# Altium project B106AA.PrjPcb (part 3 of 5)

## Sheet System Timer.SchDoc: System Timer Controller
size A4; ApprovedBy: Mehmet Günce Akkoyun; CheckedBy: Mehmet Günce Akkoyun; Author: Mehmet Günce Akkoyun; CompanyName: Ovoo Electronics; DrawnBy: Mehmet Günce Akkoyun; Engineer: Mehmet Günce Akkoyun; Organization: Ovoo Electronics; Address1: Küçük Ýhsaniye Mah.; Address2: Mýzraklý Sok. No:15; Address3: Meram / Konya; Address4: Turkiye; DocumentNumber: AA005; Revision: B106AA; SheetNumber: 7; SheetTotal: 37
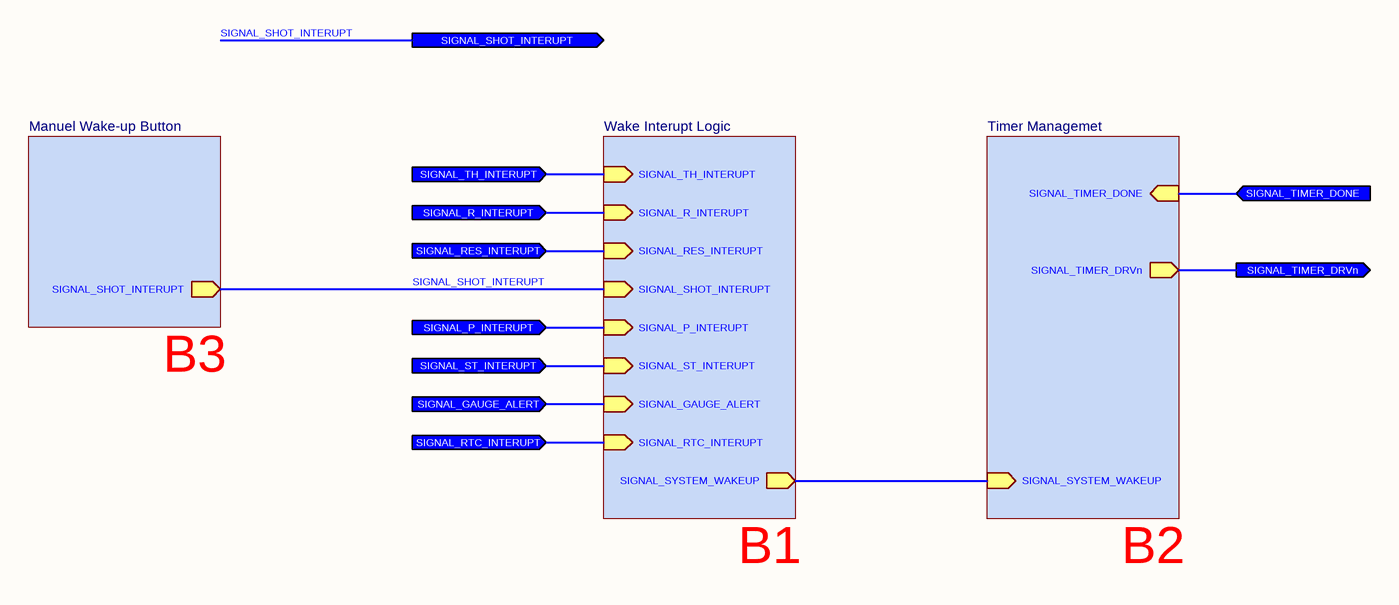
[diagram p20: System Timer.SchDoc]

### Sub-sheets
Manuel Wake-up Button = Manuel Wake-up and Latch.SchDoc: SIGNAL_SHOT_INTERUPT (out)
Timer Managemet = Time Management.SchDoc: SIGNAL_TIMER_DRVn (out), SIGNAL_TIMER_DONE (in), SIGNAL_SYSTEM_WAKEUP (in)
Wake Interupt Logic = System Wake Interupt Logic.SchDoc: SIGNAL_R_INTERUPT (in), SIGNAL_ST_INTERUPT (in), SIGNAL_SYSTEM_WAKEUP (out), SIGNAL_TH_INTERUPT (in), SIGNAL_RES_INTERUPT (in), SIGNAL_RTC_INTERUPT (in), SIGNAL_GAUGE_ALERT (in), SIGNAL_P_INTERUPT (in), SIGNAL_SHOT_INTERUPT (in)

### Ports
SIGNAL_GAUGE_ALERT (in), SIGNAL_P_INTERUPT (in), SIGNAL_R_INTERUPT (in), SIGNAL_RES_INTERUPT (in), SIGNAL_RTC_INTERUPT (in), SIGNAL_SHOT_INTERUPT (out), SIGNAL_ST_INTERUPT (in), SIGNAL_TH_INTERUPT (in), SIGNAL_TIMER_DONE (in), SIGNAL_TIMER_DRVn (out)

### Nets
SIGNAL_GAUGE_ALERT: port SIGNAL_GAUGE_ALERT, sheet Wake Interupt Logic/SIGNAL_GAUGE_ALERT
SIGNAL_P_INTERUPT: port SIGNAL_P_INTERUPT, sheet Wake Interupt Logic/SIGNAL_P_INTERUPT
SIGNAL_R_INTERUPT: port SIGNAL_R_INTERUPT, sheet Wake Interupt Logic/SIGNAL_R_INTERUPT
SIGNAL_RES_INTERUPT: port SIGNAL_RES_INTERUPT, sheet Wake Interupt Logic/SIGNAL_RES_INTERUPT
SIGNAL_RTC_INTERUPT: port SIGNAL_RTC_INTERUPT, sheet Wake Interupt Logic/SIGNAL_RTC_INTERUPT
SIGNAL_SHOT_INTERUPT: port SIGNAL_SHOT_INTERUPT, sheet Wake Interupt Logic/SIGNAL_SHOT_INTERUPT, sheet Manuel Wake-up Button/SIGNAL_SHOT_INTERUPT
SIGNAL_ST_INTERUPT: port SIGNAL_ST_INTERUPT, sheet Wake Interupt Logic/SIGNAL_ST_INTERUPT
SIGNAL_TH_INTERUPT: port SIGNAL_TH_INTERUPT, sheet Wake Interupt Logic/SIGNAL_TH_INTERUPT
SIGNAL_TIMER_DONE: port SIGNAL_TIMER_DONE, sheet Timer Managemet/SIGNAL_TIMER_DONE
SIGNAL_TIMER_DRVn: port SIGNAL_TIMER_DRVn, sheet Timer Managemet/SIGNAL_TIMER_DRVn
NetQ7_1: sheet Timer Managemet/SIGNAL_SYSTEM_WAKEUP, sheet Wake Interupt Logic/SIGNAL_SYSTEM_WAKEUP

### Notes on the sheet
- B3
- B1
- B2
- Title
- Size:
- Date:
- A4
- Number:
- Time:
- Revision:
- Sheet
- of
- File:

## Sheet Time Management.SchDoc: Sleep Management (Timer)
size A4; ApprovedBy: Mehmet Günce Akkoyun; CheckedBy: Mehmet Günce Akkoyun; Author: Mehmet Günce Akkoyun; CompanyName: Ovoo Electronics; DrawnBy: Mehmet Günce Akkoyun; Engineer: Mehmet Günce Akkoyun; Organization: Ovoo Electronics; Address1: Küçük Ýhsaniye Mah.; Address2: Mýzraklý Sok. No:15; Address3: Meram / Konya; Address4: Turkiye; DocumentNumber: AA005; Revision: B106AA; SheetNumber: 9; SheetTotal: 37
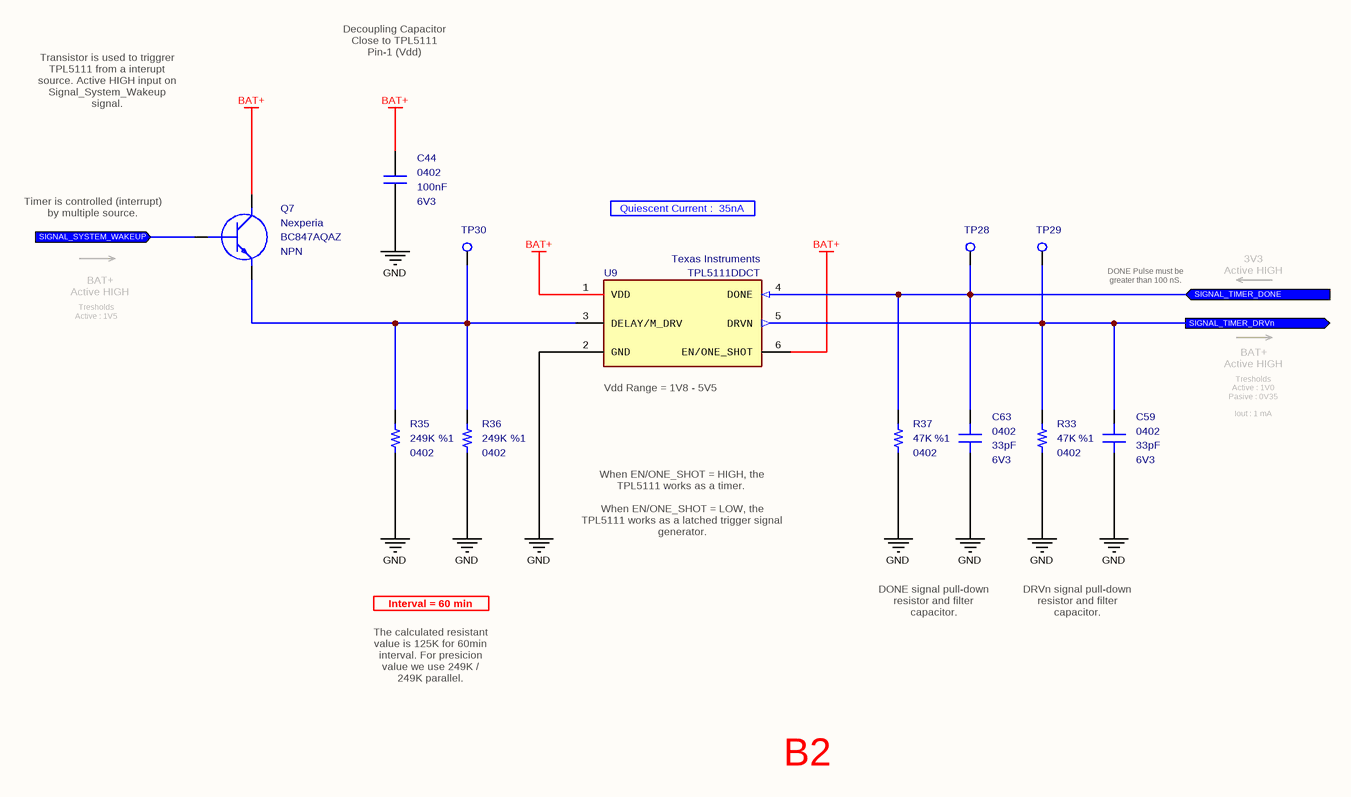
[diagram p21: Time Management.SchDoc]

### Parts
C44  value 100nF  Case: 0402  Voltage: 6V3  [CAPACITOR_0402]  (hidden comment: Multilayer Ceramic Capacitor)
C59  value 33pF  Case: 0402  Voltage: 6V3  [CAPACITOR_0402]  (hidden comment: Multilayer Ceramic Capacitor)
C63  value 33pF  Case: 0402  Voltage: 6V3  [CAPACITOR_0402]  (hidden comment: Multilayer Ceramic Capacitor)
Q7  Manufacturer_Name: Nexperia  Manufacturer_Part_Number: BC847AQAZ  Polarity: NPN  [SOT1215]  (hidden comment: Bipolar NPN Transistors)
R33  value 47K  Tolerance: %1  Case: 0402  [RESISTOR_0402]  (hidden comment: Thick Film Resistor)
R35  value 249K  Tolerance: %1  Case: 0402  [RESISTOR_0402]  (hidden comment: Thick Film Resistor)
R36  value 249K  Tolerance: %1  Case: 0402  [RESISTOR_0402]  (hidden comment: Thick Film Resistor)
R37  value 47K  Tolerance: %1  Case: 0402  [RESISTOR_0402]  (hidden comment: Thick Film Resistor)
TP28  PCB - Test Point  [Test_Pad - Hole]  (value not drawn)  (no BOM)
TP29  PCB - Test Point  [Test_Pad - Hole]  (value not drawn)  (no BOM)
TP30  PCB - Test Point  [Test_Pad - Hole]  (value not drawn)  (no BOM)
U9  Manufacturer _Part_Number: TPL5111DDCT  Manufacturer_Name: Texas Instruments  [SOT-23-6]  (hidden comment: Nanopower Timer IC)

### Ports
SIGNAL_SYSTEM_WAKEUP (in), SIGNAL_TIMER_DONE (in), SIGNAL_TIMER_DRVn (out)

### Nets
BAT+: C44.2 Q7.3(C) U9.1(VDD) U9.6(EN/ONE_SHOT)
GND: C44.1 C59.1 C63.1 R33.1 R35.1 R36.1 R37.1 U9.2(GND)
SIGNAL_TIMER_DONE: C63.2 R37.2 TP28.1 U9.4(DONE) ; port SIGNAL_TIMER_DONE
SIGNAL_TIMER_DRVn: C59.2 R33.2 TP29.1 U9.5(DRVN) ; port SIGNAL_TIMER_DRVn
NetQ7_1: Q7.1(B) ; port SIGNAL_SYSTEM_WAKEUP
NetQ7_2: Q7.2(E) R35.2 R36.2 TP30.1 U9.3(DELAY/M_DRV)

### Notes on the sheet
- Decoupling Capacitor
  Close to TPL5111
  Pin-1 (Vdd)
- Transistor is used to triggrer TPL5111 from a interupt source. Active HIGH input on Signal_System_Wakeup signal.
- (near Q7) Timer is controlled (interrupt) by multiple source.
- Quiescent Current :  35nA
- 3V3
  Active HIGH
- BAT+
  Active HIGH
- Tresholds
  Active : 1V5
- DONE Pulse must be greater than 100 nS.
- (near U9) Vdd Range = 1V8 - 5V5
- Tresholds
  Active : 1V0
  Pasive : 0V35
  Iout : 1 mA
- When EN/ONE_SHOT = HIGH, the TPL5111 works as a timer.
  When EN/ONE_SHOT = LOW, the TPL5111 works as a latched trigger signal generator.
- Interval = 60 min
- DONE signal pull-down resistor and filter capacitor.
- DRVn signal pull-down resistor and filter capacitor.
- The calculated resistant value is 125K for 60min interval. For presicion value we use 249K / 249K parallel.
- B2
- Title
- Size:
- Date:
- A4
- Number:
- Time:
- Revision:
- Sheet
- of
- File:

### Library data of the parts
C44 = Capacitor - 100nF [0402-6V3]: Capacitor - 100nF [0402-6V3] (Ceramic); Manufacturer_Name: AVX; Manufacturer_Part_Number: 04026D104KAT4A; Dielectric: X5R; Tolerance: %10; Height: 0.25mm; Mouser_Part_Number: 581-04026D104KAT4A; ComponentLink1Description: Mouser; ComponentLink1URL: https://www.mouser.com.tr/ProductDetail/AVX/04026D104KAT4A?qs=sGAEpiMZZMs0AnBnWHyRQPg4iYkCw7IMED%2F4kpqgf7w%3D; ComponentLink2Description: DataSheet; ComponentLink2URL: https://www.mouser.com.tr/datasheet/2/40/cx5r-776519.pdf; ROHS: Yes; Maximum Operating Temperature: +85; Minimum Operating Temperature: -55; Supplier 1: Avnet; Supplier Part Number 1: 04026D104KAT4A
C59 C63 = Capacitor - 33pF [0402-6V3]: Capacitor - 33pF [0402] (Ceramic); Manufacturer_Name: Kemet; Manufacturer_Part_Number: C0402C330J9RACAUTO; Dielectric: X7R; Tolerance: 10%; Height: 0.5mm; Mouser_Part_Number: 80-C0402C330J9RAUTO; Maximum Operating Temperature: +125; Minimum Operating Temperature: -55; ROHS: Yes; ComponentLink1Description: DataSheet; ComponentLink1URL: https://api.kemet.com/component-edge/download/datasheet/C0402C330J9RACAUTO.pdf; ComponentLink2Description: Mouser; ComponentLink2URL: https://www.mouser.com/Search/Refine.aspx?Keyword=80-C0402C330J9RAUTO; Supplier 1: Mouser; Supplier Part Number 1: 80-C0402C330J9RAUTO
Q7 = Transistor - BC847: as Q2-Q4 on sheet GSM LED Indicators; Mouser_Part_Number: 771-BC847AQAZ; ComponentLink1Description: DataSheet; ComponentLink1URL: https://www.mouser.com.tr/datasheet/2/916/BC847XQA_SER-1598405.pdf; ComponentLink2Description: Mouser; ComponentLink2URL: https://www.mouser.com.tr/ProductDetail/Nexperia/BC847AQAZ?qs=%2Fha2pyFaduhKMCPKNtQimeJpXTw9z4AqURd2YARs8DVICZNv3AT9Dw%3D%3D; Case: DFN-1010D-3; Supplier 1: Mouser; Supplier 2: Digi-Key; Supplier Part Number 1: 771-BC847AQAZ; Supplier Part Number 2: 1727-2545-1-ND
R33 R37 = Resistor - 47K: Thick Film Resistors - SMD 1/16 W 47 Kohms 1%; Manufacturer_Name: Vishay; Manufacturer_Part_Number: CRCW040247K0FKED; Height: 0.4mm; Mouser_Part_Number: 71-CRCW0402-47K-E3; ComponentLink1Description: DataSheet; ComponentLink1URL: https://www.mouser.com.tr/datasheet/2/427/dcrcwe3-1762152.pdf; ComponentLink2Description: Mouser; ComponentLink2URL: https://www.mouser.com.tr/ProductDetail/Vishay-Dale/CRCW040247K0FKED?qs=sGAEpiMZZMu61qfTUdNhG2DpbjADlD3GL%252B3h1elTxqU%3D; Supplier 1: Mouser; Supplier 2: Digi-Key; Supplier Part Number 1: 71-CRCW040247K0FKEDH; Supplier Part Number 2: 541-47.0KYCT-ND
R35 R36 = Resistor - 249K: Thick Film Resistors - SMD 1/16 W 249 Kohms 1%; Manufacturer_Name: Vishay; Manufacturer_Part_Number: CRCW0402249KFKED; Height: 0.35mm; Mouser_Part_Number: 71-CRCW0402-249K-E3; ComponentLink1Description: DataSheet; ComponentLink1URL: https://www.mouser.com.tr/datasheet/2/427/dcrcwe3-1762152.pdf; ComponentLink2Description: Mouser; ComponentLink2URL: https://www.mouser.com.tr/ProductDetail/Vishay-Dale/CRCW0402249KFKED?qs=sGAEpiMZZMu61qfTUdNhG2DpbjADlD3GEiYBObatoAI%3D; Supplier 1: Mouser; Supplier 2: Digi-Key; Supplier Part Number 1: 71-CRCW0402-249K-E3; Supplier Part Number 2: 541-249KLCT-ND
TP28-TP30 = PCB - Test Point: Test Point
U9 = IC - TPL5111: Timers & Support Products Ultra Low Power System Timer (35 nA) for Power Gating in duty cycled applications.; Supply Voltage - Min: 1.8V; Supply Voltage - Max: 5.5V; Height: 1.1mm; ROHS: Yes; Minimum Operating Temperature: -40; Maximum Operating Temperature: +105; ComponentLink1Description: DataSheet; ComponentLink1URL: http://www.ti.com/general/docs/suppproductinfo.tsp?distId=26&gotoUrl=http%3A%2F%2Fwww.ti.com%2Flit%2Fgpn%2Ftpl5111; Mouser_Part_Number: 595-TPL5111DDCT; ComponentLink2Description: Mouser; ComponentLink2URL: https://www.mouser.com/Search/Refine.aspx?Keyword=595-TPL5111DDCT; Supplier 1: Mouser; Supplier 2: Arrow; Supplier 3: Farnell; Supplier 4: Digi-Key; Supplier 5: Newark; Supplier Part Number 1: 595-TPL5111DDCT; Supplier Part Number 2: TPL5111DDCT; Supplier Part Number 3: 3006922; Supplier Part Number 4: 296-42621-1-ND; Supplier Part Number 5: 28AH5709

## Sheet System Wake Interupt Logic.SchDoc: System Wake up Resources Logic Gates
size A3; ApprovedBy: Mehmet Günce Akkoyun; CheckedBy: Mehmet Günce Akkoyun; Author: Mehmet Günce Akkoyun; CompanyName: Ovoo Electronics; DrawnBy: Mehmet Günce Akkoyun; Engineer: Mehmet Günce Akkoyun; Organization: Ovoo Electronics; Address1: Küçük Ýhsaniye Mah.; Address2: Mýzraklý Sok. No:15; Address3: Meram / Konya; Address4: Turkiye; DocumentNumber: AA005; Revision: B106AA; SheetNumber: 8; SheetTotal: 37
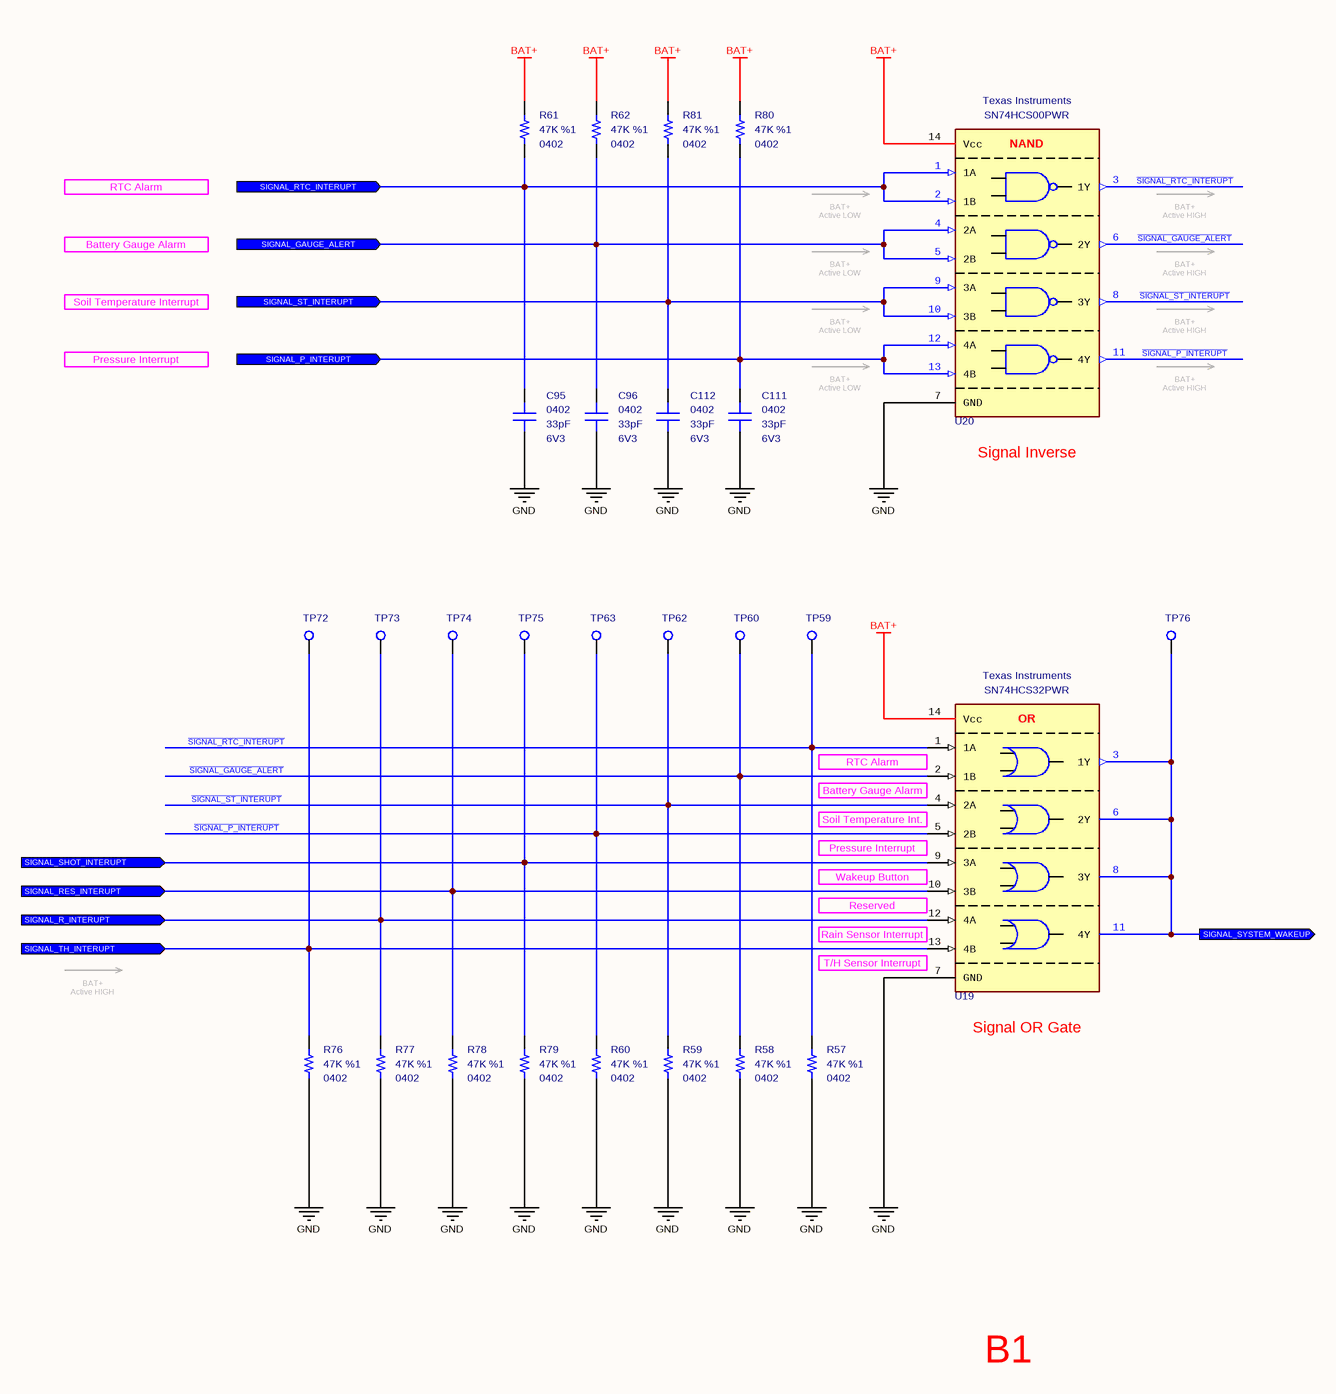
[diagram p22: System Wake Interupt Logic.SchDoc]

### Parts
C95  value 33pF  Case: 0402  Voltage: 6V3  [CAPACITOR_0402]  (hidden comment: Multilayer Ceramic Capacitor)
C96  value 33pF  Case: 0402  Voltage: 6V3  [CAPACITOR_0402]  (hidden comment: Multilayer Ceramic Capacitor)
C111  value 33pF  Case: 0402  Voltage: 6V3  [CAPACITOR_0402]  (hidden comment: Multilayer Ceramic Capacitor)
C112  value 33pF  Case: 0402  Voltage: 6V3  [CAPACITOR_0402]  (hidden comment: Multilayer Ceramic Capacitor)
R57  value 47K  Tolerance: %1  Case: 0402  [RESISTOR_0402]  (hidden comment: Thick Film Resistor)
R58  value 47K  Tolerance: %1  Case: 0402  [RESISTOR_0402]  (hidden comment: Thick Film Resistor)
R59  value 47K  Tolerance: %1  Case: 0402  [RESISTOR_0402]  (hidden comment: Thick Film Resistor)
R60  value 47K  Tolerance: %1  Case: 0402  [RESISTOR_0402]  (hidden comment: Thick Film Resistor)
R61  value 47K  Tolerance: %1  Case: 0402  [RESISTOR_0402]  (hidden comment: Thick Film Resistor)
R62  value 47K  Tolerance: %1  Case: 0402  [RESISTOR_0402]  (hidden comment: Thick Film Resistor)
R76  value 47K  Tolerance: %1  Case: 0402  [RESISTOR_0402]  (hidden comment: Thick Film Resistor)
R77  value 47K  Tolerance: %1  Case: 0402  [RESISTOR_0402]  (hidden comment: Thick Film Resistor)
R78  value 47K  Tolerance: %1  Case: 0402  [RESISTOR_0402]  (hidden comment: Thick Film Resistor)
R79  value 47K  Tolerance: %1  Case: 0402  [RESISTOR_0402]  (hidden comment: Thick Film Resistor)
R80  value 47K  Tolerance: %1  Case: 0402  [RESISTOR_0402]  (hidden comment: Thick Film Resistor)
R81  value 47K  Tolerance: %1  Case: 0402  [RESISTOR_0402]  (hidden comment: Thick Film Resistor)
TP59  PCB - Test Point  [Test_Pad - Hole]  (value not drawn)  (no BOM)
TP60  PCB - Test Point  [Test_Pad - Hole]  (value not drawn)  (no BOM)
TP62  PCB - Test Point  [Test_Pad - Hole]  (value not drawn)  (no BOM)
TP63  PCB - Test Point  [Test_Pad - Hole]  (value not drawn)  (no BOM)
TP72  PCB - Test Point  [Test_Pad - Hole]  (value not drawn)  (no BOM)
TP73  PCB - Test Point  [Test_Pad - Hole]  (value not drawn)  (no BOM)
TP74  PCB - Test Point  [Test_Pad - Hole]  (value not drawn)  (no BOM)
TP75  PCB - Test Point  [Test_Pad - Hole]  (value not drawn)  (no BOM)
TP76  PCB - Test Point  [Test_Pad - Hole]  (value not drawn)  (no BOM)
U19  Manufacturer_Part_Number: SN74HCS32PWR  Manufacturer_Name: Texas Instruments  [TSSOP-14]  (hidden comment: Logic Gate (OR))
U20  Manufacturer_Part_Number: SN74HCS00PWR  Manufacturer_Name: Texas Instruments  [TSSOP-14]  (hidden comment: Logic Gate (NAND))

### Ports
SIGNAL_GAUGE_ALERT (in), SIGNAL_P_INTERUPT (in), SIGNAL_R_INTERUPT (in), SIGNAL_RES_INTERUPT (in), SIGNAL_RTC_INTERUPT (in), SIGNAL_SHOT_INTERUPT (in), SIGNAL_ST_INTERUPT (in), SIGNAL_SYSTEM_WAKEUP (out), SIGNAL_TH_INTERUPT (in)

### Nets
BAT+: R61.2 R62.2 R80.2 R81.2 U19.14(Vcc) U20.14(Vcc)
GND: C95.1 C96.1 C111.1 C112.1 R57.1 R58.1 R59.1 R60.1 R76.1 R77.1 R78.1 R79.1 U19.7(GND) U20.7(GND)
~{SIGNAL_GAUGE_ALERT}: R58.2 TP60.1 U19.2(1B) U20.6(2Y)
~{SIGNAL_P_INTERUPT}: R60.2 TP63.1 U19.5(2B) U20.11(4Y)
~{SIGNAL_RTC_INTERUPT}: R57.2 TP59.1 U19.1(1A) U20.3(1Y)
~{SIGNAL_ST_INTERUPT}: R59.2 TP62.1 U19.4(2A) U20.8(3Y)
SIGNAL_GAUGE_ALERT: C96.2 R62.1 U20.4(2A) U20.5(2B) ; port SIGNAL_GAUGE_ALERT
SIGNAL_P_INTERUPT: C111.2 R80.1 U20.12(4A) U20.13(4B) ; port SIGNAL_P_INTERUPT
SIGNAL_R_INTERUPT: R77.2 TP73.1 U19.12(4A) ; port SIGNAL_R_INTERUPT
SIGNAL_RES_INTERUPT: R78.2 TP74.1 U19.10(3B) ; port SIGNAL_RES_INTERUPT
SIGNAL_RTC_INTERUPT: C95.2 R61.1 U20.1(1A) U20.2(1B) ; port SIGNAL_RTC_INTERUPT
SIGNAL_SHOT_INTERUPT: R79.2 TP75.1 U19.9(3A) ; port SIGNAL_SHOT_INTERUPT
SIGNAL_ST_INTERUPT: C112.2 R81.1 U20.9(3A) U20.10(3B) ; port SIGNAL_ST_INTERUPT
SIGNAL_TH_INTERUPT: R76.2 TP72.1 U19.13(4B) ; port SIGNAL_TH_INTERUPT
NetQ7_1: TP76.1 U19.3(1Y) U19.6(2Y) U19.8(3Y) U19.11(4Y) ; port SIGNAL_SYSTEM_WAKEUP

### Notes on the sheet
- RTC Alarm
- BAT+
  Active LOW
- BAT+
  Active HIGH
- Battery Gauge Alarm
- Soil Temperature Interrupt
- Pressure Interrupt
- (near U20) Signal Inverse
- (near U19) RTC Alarm
- (near U19) Battery Gauge Alarm
- (near U19) Wakeup Button
- (near U19) Pressure Interrupt
- (near U19) Soil Temperature Int.
- (near U19) Rain Sensor Interrupt
- (near U19) Reserved
- (near U19) T/H Sensor Interrupt
- (near U19) Signal OR Gate
- B1
- Title
- Size:
- Date:
- A3
- Number:
- Time:
- Revision:
- Sheet
- of
- File:
- (in symbol IC - SN74HCS00) NAND
- (in symbol IC - SN74HCS32) OR

### Library data of the parts
C95 C96 C111 C112 = Capacitor - 33pF [0402-6V3]: as C59 on sheet Time Management; Height: 0.5mm; Mouser_Part_Number: 80-C0402C330J9RAUTO; Maximum Operating Temperature: +125; Minimum Operating Temperature: -55; ROHS: Yes; ComponentLink1Description: DataSheet; ComponentLink1URL: https://api.kemet.com/component-edge/download/datasheet/C0402C330J9RACAUTO.pdf; ComponentLink2Description: Mouser; ComponentLink2URL: https://www.mouser.com/Search/Refine.aspx?Keyword=80-C0402C330J9RAUTO; Supplier 1: Mouser; Supplier Part Number 1: 80-C0402C330J9RAUTO
R57-R62 R76-R81 = Resistor - 47K: as R33 on sheet Time Management; Height: 0.4mm; Mouser_Part_Number: 71-CRCW0402-47K-E3; ComponentLink1Description: DataSheet; ComponentLink1URL: https://www.mouser.com.tr/datasheet/2/427/dcrcwe3-1762152.pdf; ComponentLink2Description: Mouser; ComponentLink2URL: https://www.mouser.com.tr/ProductDetail/Vishay-Dale/CRCW040247K0FKED?qs=sGAEpiMZZMu61qfTUdNhG2DpbjADlD3GL%252B3h1elTxqU%3D; Supplier 1: Mouser; Supplier 2: Digi-Key; Supplier Part Number 1: 71-CRCW040247K0FKEDH; Supplier Part Number 2: 541-47.0KYCT-ND
TP59 TP60 TP62 TP63 TP72-TP76 = PCB - Test Point: Test Point
U19 = IC - SN74HCS32: Logic Gates Quadruple 2-input OR gates with Schmitt-trigger inputs 14-TSSOP -40 to 125; Mouser_Part_Number: 595-SN74HCS32PWR; ComponentLink1Description: DataSheet; ComponentLink1URL: http://www.ti.com/lit/ds/symlink/sn74hcs32-q1.pdf; ComponentLink2Description: Mouser; ComponentLink2URL: https://eu.mouser.com/ProductDetail/Texas-Instruments/SN74HCS32PWR?qs=vHuUswq2%252BswZ59iFDX%252BOFA%3D%3D; Minimum Operating Temperature: -40; Maximum Operating Temperature: +125; Case: TSSOP-14; Supplier 1: Mouser; Supplier 2: Digi-Key; Supplier Part Number 1: 595-SN74HCS32PWR; Supplier Part Number 2: 296-SN74HCS32PWRCT-ND
U20 = IC - SN74HCS00: Logic Gates Quadruple 2-input NAND gates with Schmitt-trigger inputs 14-TSSOP -40 to 125; Mouser_Part_Number: 595-SN74HCS00PWR; ComponentLink1Description: DataSheet; ComponentLink1URL: http://www.ti.com/lit/ds/symlink/sn74hcs00.pdf; ComponentLink2Description: Mouser; ComponentLink2URL: https://eu.mouser.com/ProductDetail/Texas-Instruments/SN74HCS00PWR?qs=xZ%2FP%252Ba9zWqbLfT34gQ2%2FMQ%3D%3D; Minimum Operating Temperature: -40; Maximum Operating Temperature: +125; Case: TSSOP-14; Supplier 1: Mouser; Supplier 2: Digi-Key; Supplier Part Number 1: 595-SN74HCS00PWR; Supplier Part Number 2: 296-SN74HCS00PWRCT-ND

## Sheet Manuel Wake-up and Latch.SchDoc: Manuel Wake-up Button
size A4; ApprovedBy: Mehmet Günce Akkoyun; CheckedBy: Mehmet Günce Akkoyun; Author: Mehmet Günce Akkoyun; CompanyName: Ovoo Electronics; DrawnBy: Mehmet Günce Akkoyun; Engineer: Mehmet Günce Akkoyun; Organization: Ovoo Electronics; Address1: Küçük Ýhsaniye Mah.; Address2: Mýzraklý Sok. No:15; Address3: Meram / Konya; Address4: Turkiye; DocumentNumber: AA005; Revision: B106AA; SheetNumber: 10; SheetTotal: 37
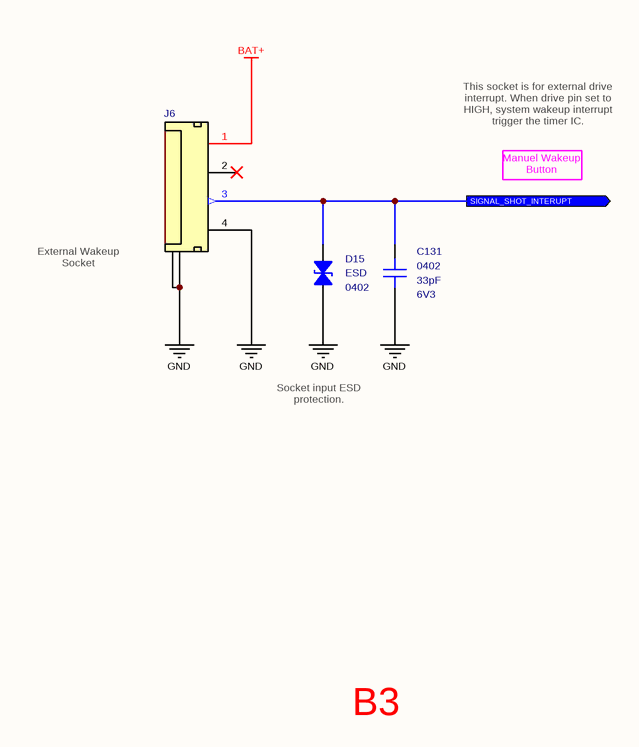
[diagram p23: Manuel Wake-up and Latch.SchDoc]

### Parts
C131  value 33pF  Case: 0402  Voltage: 6V3  [CAPACITOR_0402]  (hidden comment: Multilayer Ceramic Capacitor)
D15  Case: 0402  [ESD_0402]  (hidden comment: ESD Suppressors)
J6  4P SMD Tunic Connector  [Connector_Tunic 4P - H]  (value not drawn)

### Ports
SIGNAL_SHOT_INTERUPT (out)

### Nets
BAT+: J6.1(BAT+)
GND: C131.1 D15.1 J6.4(GND) J6.5(Termination) J6.6(Termination)
SIGNAL_SHOT_INTERUPT: C131.2 D15.2 J6.3(Button) ; port SIGNAL_SHOT_INTERUPT

Not connected (* = marked no-connect by the designer): J6 2(NC)*

### Notes on the sheet
- This socket is for external drive interrupt. When drive pin set to HIGH, system wakeup interrupt trigger the timer IC.
- Manuel Wakeup Button
- (near J6) External Wakeup
  Socket
- Socket input ESD protection.
- B3
- Title
- Size:
- Date:
- A4
- Number:
- Time:
- Revision:
- Sheet
- of
- File:
- (in symbol Diode - ESD Protection) ESD

### Library data of the parts
C131 = Capacitor - 33pF [0402-6V3]: as C59 on sheet Time Management; Height: 0.5mm; Mouser_Part_Number: 80-C0402C330J9RAUTO; Maximum Operating Temperature: +125; Minimum Operating Temperature: -55; ROHS: Yes; ComponentLink1Description: DataSheet; ComponentLink1URL: https://api.kemet.com/component-edge/download/datasheet/C0402C330J9RACAUTO.pdf; ComponentLink2Description: Mouser; ComponentLink2URL: https://www.mouser.com/Search/Refine.aspx?Keyword=80-C0402C330J9RAUTO; Supplier 1: Mouser; Supplier Part Number 1: 80-C0402C330J9RAUTO
D15 = Diode - ESD Protection: TVS Diode (Bi-directional); Manufacturer_Name: Bussmann / Eaton; Manufacturer_Part_Number: 0402ESDA-MLP1; Clamping Voltage: 35V; Diode Capacitance: 0.05pF; Polarity: Bidirectional; Voltage ESD Air Gap: 15kV; Voltage ESD Contact: 8kV; Working Voltage: 30V; Height: 0.436mm; Mouser_Part_Number: 504-0402ESDA-MLP1; Maximum Operating Temperature: +125; Minimum Operating Temperature: -55; ROHS: Yes; ComponentLink1Description: DataSheet; ComponentLink1URL: https://www.mouser.com.tr/datasheet/2/87/47c59e11-d058-4882-bc35-d8572f2ca054-38826.pdf; ComponentLink2Description: Mouser; ComponentLink2URL: https://www.mouser.com.tr/ProductDetail/Bussmann-Eaton/0402ESDA-MLP1?qs=%2Fha2pyFadughxyc7TyLWeW%2FUvipVY6Ex3naV%2FjpO3plZBZWDLqV4bw%3D%3D; Supplier 1: Mouser; Supplier 2: Digi-Key; Supplier Part Number 2: 283-2964-1-ND; Supplier Part Number 1: 504-0402ESDA-MLP1
J6 = Connector - Mini Tunic 4P (1.25): Mini Tunic Connector with 4P; Manufacturer_Part_Number: 53261-0471; Manufacturer_Name: Molex; Pitch: 1.25mm; Position: 4; ROHS: Yes; ComponentLink1Description: DataSheet; ComponentLink1URL: https://www.mouser.com.tr/datasheet/2/276/0532610471_PCB_HEADERS-170942.pdf; ComponentLink2Description: Mouser; ComponentLink2URL: https://www.mouser.com.tr/ProductDetail/Molex/53261-0471?qs=%2Fha2pyFaduhLhIsk8tywtK7BwWtguBSP4XxyDBTOTfs%3D; Case: SMD; Mouser_Part_Number: 538-53261-0471; Supplier 1: Mouser; Supplier 2: Digi-Key; Supplier Part Number 1: 538-53261-0471; Supplier Part Number 2: WM7622CT-ND; System: Connector

## Sheet Power Regulator.SchDoc: System Power Regulators & GSM IoT Power Switch
size A4; ApprovedBy: Mehmet Günce Akkoyun; CheckedBy: Mehmet Günce Akkoyun; Author: Mehmet Günce Akkoyun; CompanyName: Ovoo Electronics; DrawnBy: Mehmet Günce Akkoyun; Engineer: Mehmet Günce Akkoyun; Organization: Ovoo Electronics; Address1: Küçük Ýhsaniye Mah.; Address2: Mýzraklý Sok. No:15; Address3: Meram / Konya; Address4: Turkiye; DocumentNumber: AA005; Revision: B106AA; SheetNumber: 11; SheetTotal: 37
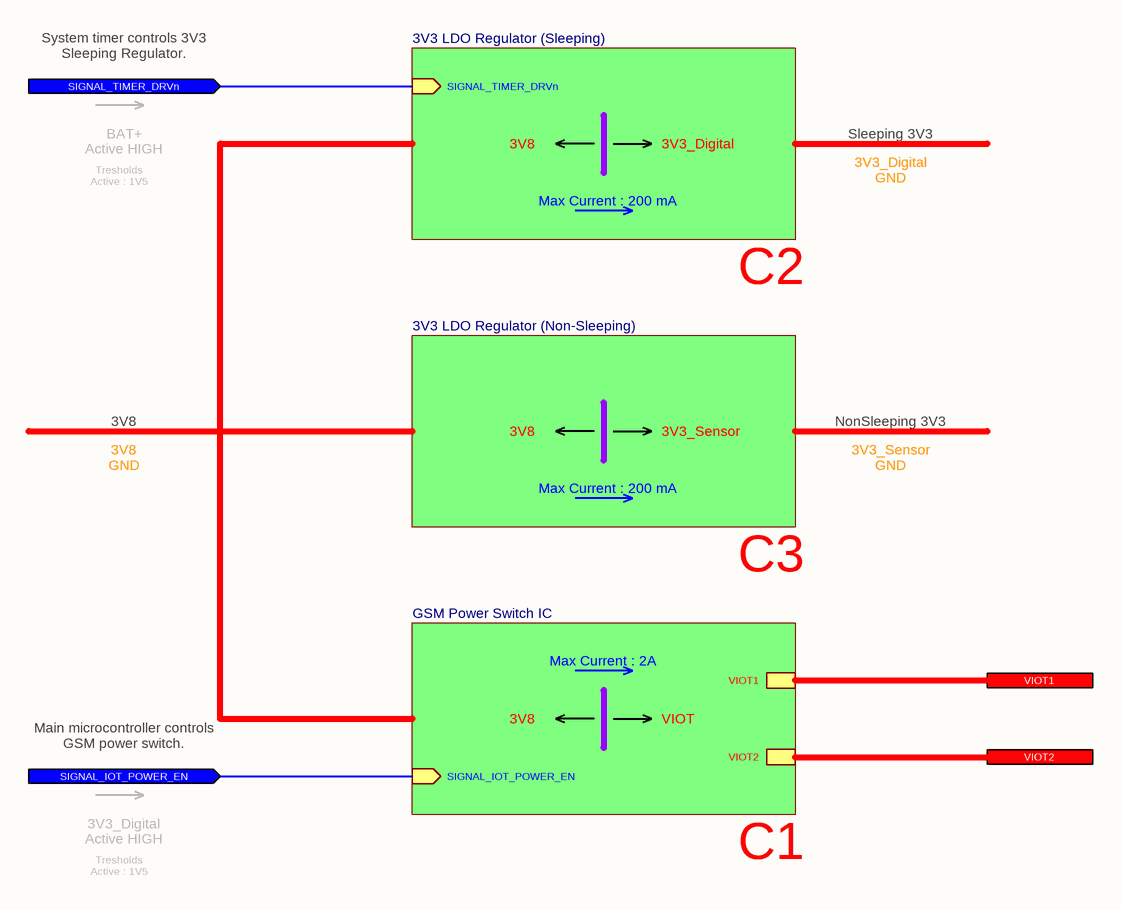
[diagram p24: Power Regulator.SchDoc]

### Sub-sheets
3V3 LDO Regulator (Non-Sleeping) = 3V3 LDO Regulator (NonSleeping).SchDoc: no entries
3V3 LDO Regulator (Sleeping) = 3V3 LDO Regulator (Sleeping).SchDoc: SIGNAL_TIMER_DRVn (in)
GSM Power Switch IC = GSM Power On-Off Switch IC.SchDoc: SIGNAL_IOT_POWER_EN (in), VIOT2, VIOT1

### Ports
SIGNAL_IOT_POWER_EN (in), SIGNAL_TIMER_DRVn (in), VIOT1, VIOT2

### Nets
SIGNAL_IOT_POWER_EN: port SIGNAL_IOT_POWER_EN, sheet GSM Power Switch IC/SIGNAL_IOT_POWER_EN
SIGNAL_TIMER_DRVn: port SIGNAL_TIMER_DRVn, sheet 3V3 LDO Regulator (Sleeping)/SIGNAL_TIMER_DRVn
VIOT1: port VIOT1, sheet GSM Power Switch IC/VIOT1
VIOT2: port VIOT2, sheet GSM Power Switch IC/VIOT2

### Notes on the sheet
- System timer controls 3V3 Sleeping Regulator.
- BAT+
  Active HIGH
- 3V8
- 3V3_Digital
- Sleeping 3V3
- Tresholds
  Active : 1V5
- Max Current : 200 mA
- 3V3_Digital
  GND
- C2
- 3V8
  GND
- 3V3_Sensor
- NonSleeping 3V3
- 3V3_Sensor
  GND
- C3
- Max Current : 2A
- VIOT
- Main microcontroller controls GSM power switch.
- 3V3_Digital
  Active HIGH
- C1
- Title
- Size:
- Date:
- A4
- Number:
- Time:
- Revision:
- Sheet
- of
- File:

## Sheet GSM Power On-Off Switch IC.SchDoc: GSM Module Power On/Off Switch IC & IoT Power Filter
size A4; ApprovedBy: Mehmet Günce Akkoyun; CheckedBy: Mehmet Günce Akkoyun; Author: Mehmet Günce Akkoyun; CompanyName: Ovoo Electronics; DrawnBy: Mehmet Günce Akkoyun; Engineer: Mehmet Günce Akkoyun; Organization: Ovoo Electronics; Address1: Küçük Ýhsaniye Mah.; Address2: Mýzraklý Sok. No:15; Address3: Meram / Konya; Address4: Turkiye; DocumentNumber: AA005; Revision: B106AA; SheetNumber: 12; SheetTotal: 37
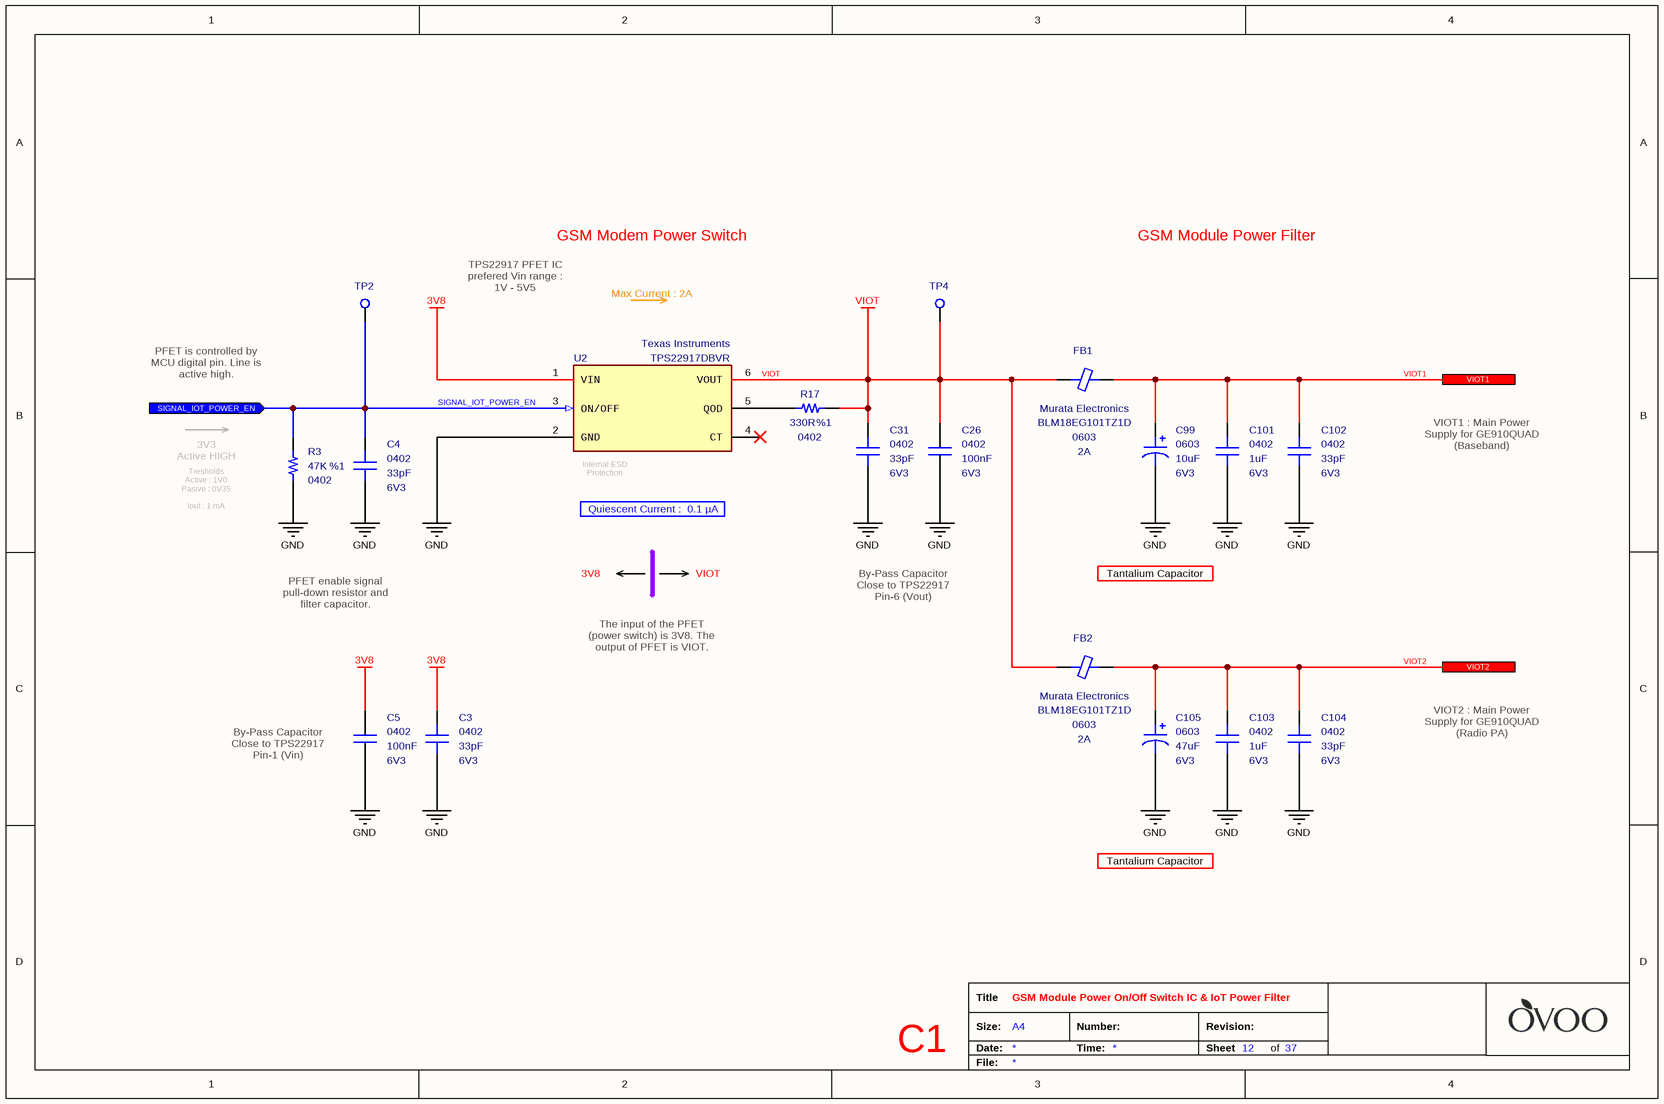
[diagram p25: GSM Power On-Off Switch IC.SchDoc]

### Parts
C3  value 33pF  Case: 0402  Voltage: 6V3  [CAPACITOR_0402]  (hidden comment: Multilayer Ceramic Capacitor)
C4  value 33pF  Case: 0402  Voltage: 6V3  [CAPACITOR_0402]  (hidden comment: Multilayer Ceramic Capacitor)
C5  value 100nF  Case: 0402  Voltage: 6V3  [CAPACITOR_0402]  (hidden comment: Multilayer Ceramic Capacitor)
C26  value 100nF  Case: 0402  Voltage: 6V3  [CAPACITOR_0402]  (hidden comment: Multilayer Ceramic Capacitor)
C31  value 33pF  Case: 0402  Voltage: 6V3  [CAPACITOR_0402]  (hidden comment: Multilayer Ceramic Capacitor)
C99  value 10uF  Case: 0603  Voltage: 6V3  [CAPACITOR_0603 - TANTALUM]  (hidden comment: Tantalum Capacitor)
C101  value 1uF  Case: 0402  Voltage: 6V3  [CAPACITOR_0402]  (hidden comment: Multilayer Ceramic Capacitor)
C102  value 33pF  Case: 0402  Voltage: 6V3  [CAPACITOR_0402]  (hidden comment: Multilayer Ceramic Capacitor)
C103  value 1uF  Case: 0402  Voltage: 6V3  [CAPACITOR_0402]  (hidden comment: Multilayer Ceramic Capacitor)
C104  value 33pF  Case: 0402  Voltage: 6V3  [CAPACITOR_0402]  (hidden comment: Multilayer Ceramic Capacitor)
C105  value 47uF  Case: 0603  Voltage: 6V3  [CAPACITOR_0603 - TANTALUM]  (hidden comment: Tantalum Capacitor)
FB1  value BLM18EG101TZ1D  Manufacturer_Name: Murata Electronics  Case: 0603  Maximum DC Current: 2A  [INDUCATOR_0603]  (hidden comment: Ferrite Bead)
FB2  value BLM18EG101TZ1D  Manufacturer_Name: Murata Electronics  Case: 0603  Maximum DC Current: 2A  [INDUCATOR_0603]  (hidden comment: Ferrite Bead)
R3  value 47K  Tolerance: %1  Case: 0402  [RESISTOR_0402]  (hidden comment: Thick Film Resistor)
R17  value 330R  Tolerance: %1  Case: 0402  [RESISTOR_0402]  (hidden comment: Thick Film Resistor)
TP2  PCB - Test Point  [Test_Pad - Hole]  (value not drawn)  (no BOM)
TP4  PCB - Test Point  [Test_Pad - Hole]  (value not drawn)  (no BOM)
U2  Manufacturer_Part_Number: TPS22917DBVR  Manufacturer_Name: Texas Instruments  [SOT-23-6]  (hidden comment: Power Switch)

### Ports
SIGNAL_IOT_POWER_EN (in), VIOT1, VIOT2

### Nets
3V8: C3.2 C5.1 U2.1(VIN)
GND: C3.1 C4.1 C5.2 C26.2 C31.1 C99.2 C101.1 C102.1 C103.1 C104.1 C105.2 R3.1 U2.2(GND)
VIOT: C26.1 C31.2 FB1.1 FB2.1 R17.1 TP4.1 U2.6(VOUT)
SIGNAL_IOT_POWER_EN: C4.2 R3.2 TP2.1 U2.3(ON/OFF) ; port SIGNAL_IOT_POWER_EN
VIOT1: C99.1 C101.2 C102.2 FB1.2 ; port VIOT1
VIOT2: C103.2 C104.2 C105.1 FB2.2 ; port VIOT2
NetR17_2: R17.2 U2.5(QOD)

Not connected (* = marked no-connect by the designer): U2 4(CT)*

### Notes on the sheet
- GSM Modem Power Switch
- GSM Module Power Filter
- TPS22917 PFET IC prefered Vin range : 1V - 5V5
- Max Current : 2A
- PFET is controlled by MCU digital pin. Line is active high.
- (near R3) 3V3
  Active HIGH
- (near U2) Internal ESD Protection
- VIOT1 : Main Power Supply for GE910QUAD (Baseband)
- (near R3) Tresholds
  Active : 1V0
  Pasive : 0V35
  Iout : 1 mA
- Quiescent Current :  0.1 µA
- PFET enable signal pull-down resistor and filter capacitor.
- 3V8
- VIOT
- By-Pass Capacitor
  Close to TPS22917
  Pin-6 (Vout)
- Tantalium Capacitor
- The input of the PFET (power switch) is 3V8. The output of PFET is VIOT.
- (near C5) By-Pass Capacitor
  Close to TPS22917
  Pin-1 (Vin)
- VIOT2 : Main Power Supply for GE910QUAD (Radio PA)
- C1
- Title
- Size:
- Date:
- A4
- Number:
- Time:
- Revision:
- Sheet
- of
- File:

### Library data of the parts
C3 C4 C31 C102 C104 = Capacitor - 33pF [0402-6V3]: as C59 on sheet Time Management; Height: 0.5mm; Mouser_Part_Number: 80-C0402C330J9RAUTO; Maximum Operating Temperature: +125; Minimum Operating Temperature: -55; ROHS: Yes; ComponentLink1Description: DataSheet; ComponentLink1URL: https://api.kemet.com/component-edge/download/datasheet/C0402C330J9RACAUTO.pdf; ComponentLink2Description: Mouser; ComponentLink2URL: https://www.mouser.com/Search/Refine.aspx?Keyword=80-C0402C330J9RAUTO; Supplier 1: Mouser; Supplier Part Number 1: 80-C0402C330J9RAUTO
C5 C26 = Capacitor - 100nF [0402-6V3]: as C44 on sheet Time Management; Height: 0.25mm; Mouser_Part_Number: 581-04026D104KAT4A; ComponentLink1Description: Mouser; ComponentLink1URL: https://www.mouser.com.tr/ProductDetail/AVX/04026D104KAT4A?qs=sGAEpiMZZMs0AnBnWHyRQPg4iYkCw7IMED%2F4kpqgf7w%3D; ComponentLink2Description: DataSheet; ComponentLink2URL: https://www.mouser.com.tr/datasheet/2/40/cx5r-776519.pdf; ROHS: Yes; Maximum Operating Temperature: +85; Minimum Operating Temperature: -55; Supplier 1: Avnet; Supplier Part Number 1: 04026D104KAT4A
C99 = Capacitor - 10uF [0603-6V3] (Tantalium): Capacitor - 10uF [0603] (Tantalium); Manufacturer_Name: AVX; Manufacturer_Part_Number: F380J106MMAAH3; ESR: 200 mOhms; Leakage Current: 10uA; Tolerance: 20%; Height: 0.8mm; Mouser_Part_Number: 581-F380J106MMAAH3; Maximum Operating Temperature: +105; Minimum Operating Temperature: -55; ROHS: Yes; ComponentLink1Description: DataSheet; ComponentLink1URL: https://www.mouser.com.tr/datasheet/2/40/f38-775706.pdf; ComponentLink2Description: Mouser; ComponentLink2URL: https://www.mouser.com.tr/ProductDetail/AVX/F380J106MMAAH3?qs=sGAEpiMZZMtZ1n0r9vR22fixilZl6Mr8zRKleESmvcDFwZ4LSyC6Pg%3D%3D; Supplier 1: Mouser; Supplier 2: Digi-Key; Supplier Part Number 2: 478-12031-1-ND; Supplier Part Number 1: 581-F380J106MMAAH3
C101 C103 = Capacitor - 1uF [0402-6V3): Capacitor - 1uF [0402] (Ceramic); Manufacturer_Name: Murata Electronics; Manufacturer_Part_Number: GRM153R60J105ME95D; Dielectric: X5R; Tolerance: 20%; Height: 0.3mm; Mouser_Part_Number: 81-GRM153R60J105ME5D; Maximum Operating Temperature: +85; Minimum Operating Temperature: -55; RoHS: Yes; Weight: 6mg; ComponentLink1Description: DataSheet; ComponentLink1URL: https://psearch.en.murata.com/capacitor/product/GRM153R60J105ME95%23.html; ComponentLink2Description: Mouser; ComponentLink2URL: https://www.mouser.com/Search/Refine.aspx?Keyword=81-GRM153R60J105ME5D; Supplier 1: Future Electronics; Supplier 2: Future Electronics; Supplier 3: Mouser; Supplier 4: Arrow; Supplier 5: Digi-Key; Supplier Part Number 5: 490-14576-1-ND; Supplier Part Number 4: GRM153R60J105ME95D; Supplier Part Number 3: 81-GRM153R60J105ME5D; Supplier Part Number 2: GRM153R60J105ME95D-REEL; Supplier Part Number 1: GRM153R60J105ME95D-CUTT
C105 = Capacitor - 47u [0603-6V3] (Tantalium): Capacitor - 47uF [0603] (Tantalium); Manufacturer_Name: AVX; Manufacturer_Part_Number: F380J476MMAAXEH3; ESR: 300 mOhms; Leakage Current: 59.2uA; Tolerance: 20%; Height: 0.8 mm; Mouser_Part_Number: 581-F380J476MMAAXEH3; Maximum Operating Temperature: +105; Minimum Operating Temperature: -55; ROHS: Yes; Weight: 2mg; ComponentLink1Description: DataSheet; ComponentLink1URL: https://www.mouser.com.tr/datasheet/2/40/f38-775706.pdf; ComponentLink2Description: Mouser; ComponentLink2URL: https://www.mouser.com.tr/ProductDetail/AVX/F380J476MMAAXEH3?qs=sGAEpiMZZMtZ1n0r9vR22RxGXmrWTp1dAwL15%252BtiGosce1Uk5KTrYw%3D%3D; Supplier 1: Avnet; Supplier Part Number 1: F380J476MMAAXEH3
FB1 FB2 = Ferrite Bead - 2A [0603]: Ferrite Beads 0603 100ohms 2000mA Auto Infotainment; Tolerance: 25%; Maximum DC Resistance: 45 mOhms; Height: 0.75mm; Manufacturer_Part_Number: BLM18EG101TZ1D; Mouser_Part_Number: 81-BLM18EG101TZ1D; Mouser_Price/Stock: https://www.mouser.com/Search/Refine.aspx?Keyword=81-BLM18EG101TZ1D; ROHS: Yes; Minimum Operating Temperature: -55; Maximum Operating Temperature: +125; Impedance: 100 Ohms; ComponentLink1Description: DataSheet; ComponentLink1URL: http://www.murata.com/~/media/webrenewal/support/library/catalog/products/emc/emifil/c31e.ashx?la=en-gb; ComponentLink2Description: Mouser; ComponentLink2URL: https://www.mouser.com/Search/Refine.aspx?Keyword=81-BLM18EG101TZ1D; Supplier 1: Mouser; Supplier Part Number 1: 81-BLM18EG101TZ1D
R3 = Resistor - 47K: as R33 on sheet Time Management; Height: 0.4mm; Mouser_Part_Number: 71-CRCW0402-47K-E3; ComponentLink1Description: DataSheet; ComponentLink1URL: https://www.mouser.com.tr/datasheet/2/427/dcrcwe3-1762152.pdf; ComponentLink2Description: Mouser; ComponentLink2URL: https://www.mouser.com.tr/ProductDetail/Vishay-Dale/CRCW040247K0FKED?qs=sGAEpiMZZMu61qfTUdNhG2DpbjADlD3GL%252B3h1elTxqU%3D; Supplier 1: Mouser; Supplier 2: Digi-Key; Supplier Part Number 1: 71-CRCW040247K0FKEDH; Supplier Part Number 2: 541-47.0KYCT-ND
R17 = Resistor - 330R: Thick Film Resistors - SMD 1/16 W 330 Ohm 1%; Manufacturer_Name: Vishay; Manufacturer_Part_Number: CRCW0402330RFKED; Height: 0.4mm; Mouser_Part_Number: 71-CRCW0402-330-E3; ComponentLink1Description: DataSheet; ComponentLink1URL: https://www.mouser.com.tr/datasheet/2/427/dcrcwe3-1762152.pdf; ComponentLink2Description: Mouser; ComponentLink2URL: https://www.mouser.com.tr/ProductDetail/Vishay-Dale/CRCW0402330RFKED?qs=sGAEpiMZZMu61qfTUdNhG2DpbjADlD3GGS6SwBlLi5Q%3D; Supplier 1: Mouser; Supplier 2: Digi-Key; Supplier Part Number 2: 541-330LCT-ND; Supplier Part Number 1: 71-CRCW0402-330-E3
TP2 TP4 = PCB - Test Point: Test Point
U2 = IC - TPS22917DBVR: Power Switch MosFet; Height: 1.45mm; Mouser_Part_Number: 595-TPS22917DBVR; ComponentLink1Description: DataSheet; ComponentLink1URL: http://www.ti.com/lit/gpn/tps22917; ComponentLink2Description: Mouser; ComponentLink2URL: https://www.mouser.com/Search/Refine.aspx?Keyword=595-TPS22917DBVR; Supplier 1: Mouser; Supplier 2: Digi-Key; Supplier Part Number 1: 595-TPS22917DBVR; Supplier Part Number 2: 296-50498-1-ND

## Sheet 3V3 LDO Regulator (NonSleeping).SchDoc: 3V3 LDO Voltage Regulator (NonSleeping)
size A4; ApprovedBy: Mehmet Günce Akkoyun; CheckedBy: Mehmet Günce Akkoyun; Author: Mehmet Günce Akkoyun; CompanyName: Ovoo Electronics; DrawnBy: Mehmet Günce Akkoyun; Engineer: Mehmet Günce Akkoyun; Organization: Ovoo Electronics; Address1: Küçük Ýhsaniye Mah.; Address2: Mýzraklý Sok. No:15; Address3: Meram / Konya; Address4: Turkiye; DocumentNumber: AA005; Revision: B106AA; SheetNumber: 14; SheetTotal: 37
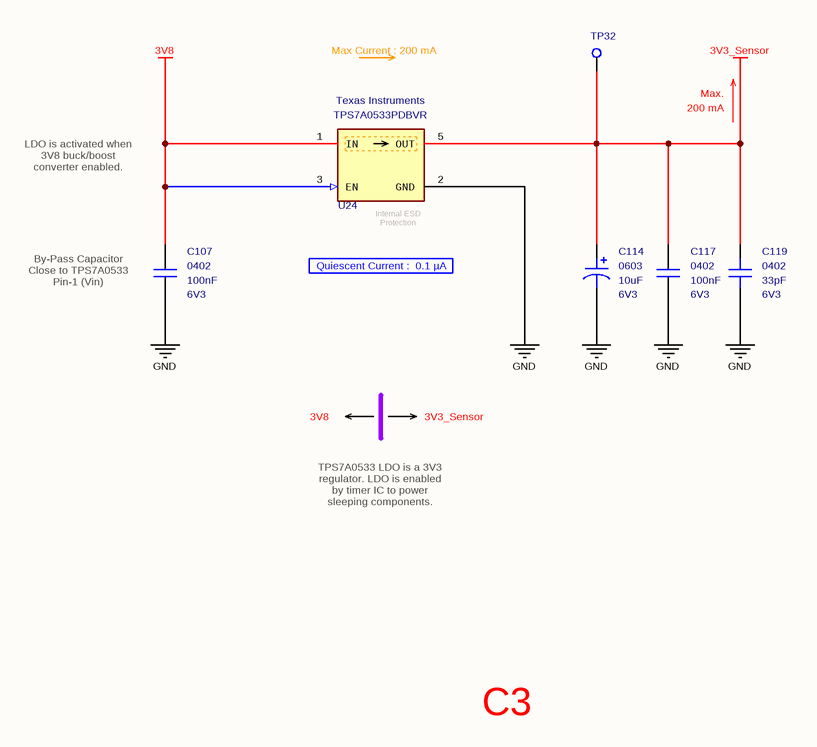
[diagram p26: 3V3 LDO Regulator (NonSleeping).SchDoc]

### Parts
C107  value 100nF  Case: 0402  Voltage: 6V3  [CAPACITOR_0402]  (hidden comment: Multilayer Ceramic Capacitor)
C114  value 10uF  Case: 0603  Voltage: 6V3  [CAPACITOR_0603 - TANTALUM]  (hidden comment: Tantalum Capacitor)
C117  value 100nF  Case: 0402  Voltage: 6V3  [CAPACITOR_0402]  (hidden comment: Multilayer Ceramic Capacitor)
C119  value 33pF  Case: 0402  Voltage: 6V3  [CAPACITOR_0402]  (hidden comment: Multilayer Ceramic Capacitor)
TP32  PCB - Test Point  [Test_Pad - Hole]  (value not drawn)  (no BOM)
U24  Manufacturer_Part_Number: TPS7A0533PDBVR  Manufacturer_Name: Texas Instruments  [SOT-23-5]  (hidden comment: LDO Voltage Regulator)

### Nets
3V3_Sensor: C114.1 C117.2 C119.1 TP32.1 U24.5(OUT)
3V8: C107.1 U24.1(IN) U24.3(EN)
GND: C107.2 C114.2 C117.1 C119.2 U24.2(GND)

### Notes on the sheet
- Max Current : 200 mA
- Max.
- 200 mA
- LDO is activated when 3V8 buck/boost converter enabled.
- (near U24) Internal ESD Protection
- (near C107) By-Pass Capacitor
  Close to TPS7A0533
  Pin-1 (Vin)
- Quiescent Current :  0.1 µA
- 3V8
- 3V3_Sensor
- TPS7A0533 LDO is a 3V3 regulator. LDO is enabled by timer IC to power sleeping components.
- C3
- Title
- Size:
- Date:
- A4
- Number:
- Time:
- Revision:
- Sheet
- of
- File:

### Library data of the parts
C107 C117 = Capacitor - 100nF [0402-6V3]: as C44 on sheet Time Management; Height: 0.25mm; Mouser_Part_Number: 581-04026D104KAT4A; ComponentLink1Description: Mouser; ComponentLink1URL: https://www.mouser.com.tr/ProductDetail/AVX/04026D104KAT4A?qs=sGAEpiMZZMs0AnBnWHyRQPg4iYkCw7IMED%2F4kpqgf7w%3D; ComponentLink2Description: DataSheet; ComponentLink2URL: https://www.mouser.com.tr/datasheet/2/40/cx5r-776519.pdf; ROHS: Yes; Maximum Operating Temperature: +85; Minimum Operating Temperature: -55; Supplier 1: Avnet; Supplier Part Number 1: 04026D104KAT4A
C114 = Capacitor - 10uF [0603-6V3] (Tantalium): as C99 on sheet GSM Power On-Off Switch IC; Height: 0.8mm; Mouser_Part_Number: 581-F380J106MMAAH3; Maximum Operating Temperature: +105; Minimum Operating Temperature: -55; ROHS: Yes; ComponentLink1Description: DataSheet; ComponentLink1URL: https://www.mouser.com.tr/datasheet/2/40/f38-775706.pdf; ComponentLink2Description: Mouser; ComponentLink2URL: https://www.mouser.com.tr/ProductDetail/AVX/F380J106MMAAH3?qs=sGAEpiMZZMtZ1n0r9vR22fixilZl6Mr8zRKleESmvcDFwZ4LSyC6Pg%3D%3D; Supplier 1: Mouser; Supplier 2: Digi-Key; Supplier Part Number 2: 478-12031-1-ND; Supplier Part Number 1: 581-F380J106MMAAH3
C119 = Capacitor - 33pF [0402-6V3]: as C59 on sheet Time Management; Height: 0.5mm; Mouser_Part_Number: 80-C0402C330J9RAUTO; Maximum Operating Temperature: +125; Minimum Operating Temperature: -55; ROHS: Yes; ComponentLink1Description: DataSheet; ComponentLink1URL: https://api.kemet.com/component-edge/download/datasheet/C0402C330J9RACAUTO.pdf; ComponentLink2Description: Mouser; ComponentLink2URL: https://www.mouser.com/Search/Refine.aspx?Keyword=80-C0402C330J9RAUTO; Supplier 1: Mouser; Supplier Part Number 1: 80-C0402C330J9RAUTO
TP32 = PCB - Test Point: Test Point
U24 = IC - TPS7A0533PDBVR: LDO Voltage Regulators Cap-Free NMOS 200mA; Output Voltage: 3V3; Dropout Voltage - Max: 235 mV at 200 mA; Mouser_Part_Number: 595-TPS7A0533PDBVR; ComponentLink1Description: DataSheet; ComponentLink1URL: http://www.ti.com/general/docs/suppproductinfo.tsp?distId=26&gotoUrl=http%3A%2F%2Fwww.ti.com%2Flit%2Fgpn%2Ftps731; ComponentLink2Description: Mouser; ComponentLink2URL: https://eu.mouser.com/ProductDetail/Texas-Instruments/TPS73150DBVR?qs=6zVL%252ByCp0mpoSoYHNmngNA%3D%3D; Minimum Operating Temperature: -40; Output Current: 200 mA; Maximum Operating Temperature: +125; Supplier 1: Mouser; Supplier 2: Digi-Key; Case: SOT-23-5; Supplier Part Number 1: 595-TPS7A0533PDBVR; Supplier Part Number 2: 296-TPS7A0533PDBVRCT-ND

## Sheet 3V3 LDO Regulator (Sleeping).SchDoc: 3V3 LDO Voltage Regulator (Sleeping)
size A4; ApprovedBy: Mehmet Günce Akkoyun; CheckedBy: Mehmet Günce Akkoyun; Author: Mehmet Günce Akkoyun; CompanyName: Ovoo Electronics; DrawnBy: Mehmet Günce Akkoyun; Engineer: Mehmet Günce Akkoyun; Organization: Ovoo Electronics; Address1: Küçük Ýhsaniye Mah.; Address2: Mýzraklý Sok. No:15; Address3: Meram / Konya; Address4: Turkiye; DocumentNumber: AA005; Revision: B106AA; SheetNumber: 13; SheetTotal: 37
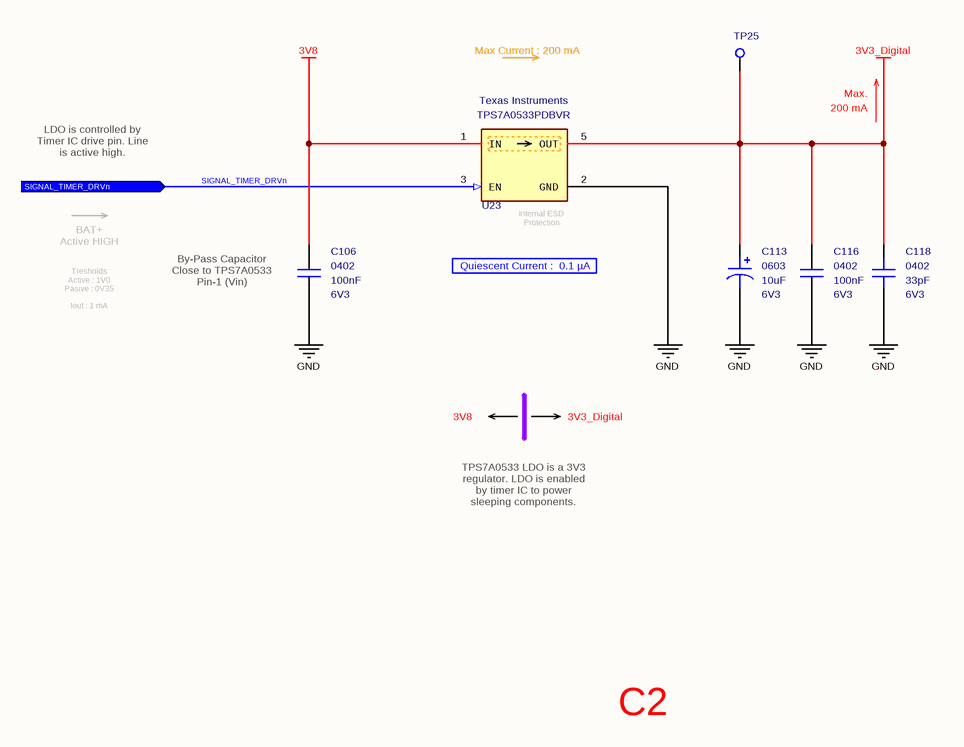
[diagram p27: 3V3 LDO Regulator (Sleeping).SchDoc]

### Parts
C106  value 100nF  Case: 0402  Voltage: 6V3  [CAPACITOR_0402]  (hidden comment: Multilayer Ceramic Capacitor)
C113  value 10uF  Case: 0603  Voltage: 6V3  [CAPACITOR_0603 - TANTALUM]  (hidden comment: Tantalum Capacitor)
C116  value 100nF  Case: 0402  Voltage: 6V3  [CAPACITOR_0402]  (hidden comment: Multilayer Ceramic Capacitor)
C118  value 33pF  Case: 0402  Voltage: 6V3  [CAPACITOR_0402]  (hidden comment: Multilayer Ceramic Capacitor)
TP25  PCB - Test Point  [Test_Pad - Hole]  (value not drawn)  (no BOM)
U23  Manufacturer_Part_Number: TPS7A0533PDBVR  Manufacturer_Name: Texas Instruments  [SOT-23-5]  (hidden comment: LDO Voltage Regulator)

### Ports
SIGNAL_TIMER_DRVn (in)

### Nets
3V3_Digital: C113.1 C116.2 C118.1 TP25.1 U23.5(OUT)
3V8: C106.1 U23.1(IN)
GND: C106.2 C113.2 C116.1 C118.2 U23.2(GND)
SIGNAL_TIMER_DRVn: U23.3(EN) ; port SIGNAL_TIMER_DRVn

### Notes on the sheet
- Max Current : 200 mA
- Max.
- LDO is controlled by Timer IC drive pin. Line is active high.
- 200 mA
- (near U23) Internal ESD Protection
- BAT+
  Active HIGH
- (near C106) By-Pass Capacitor
  Close to TPS7A0533
  Pin-1 (Vin)
- Quiescent Current :  0.1 µA
- Tresholds
  Active : 1V0
  Pasive : 0V35
  Iout : 1 mA
- 3V8
- 3V3_Digital
- TPS7A0533 LDO is a 3V3 regulator. LDO is enabled by timer IC to power sleeping components.
- C2
- Title
- Size:
- Date:
- A4
- Number:
- Time:
- Revision:
- Sheet
- of
- File:

### Library data of the parts
C106 C116 = Capacitor - 100nF [0402-6V3]: as C44 on sheet Time Management; Height: 0.25mm; Mouser_Part_Number: 581-04026D104KAT4A; ComponentLink1Description: Mouser; ComponentLink1URL: https://www.mouser.com.tr/ProductDetail/AVX/04026D104KAT4A?qs=sGAEpiMZZMs0AnBnWHyRQPg4iYkCw7IMED%2F4kpqgf7w%3D; ComponentLink2Description: DataSheet; ComponentLink2URL: https://www.mouser.com.tr/datasheet/2/40/cx5r-776519.pdf; ROHS: Yes; Maximum Operating Temperature: +85; Minimum Operating Temperature: -55; Supplier 1: Avnet; Supplier Part Number 1: 04026D104KAT4A
C113 = Capacitor - 10uF [0603-6V3] (Tantalium): as C99 on sheet GSM Power On-Off Switch IC; Height: 0.8mm; Mouser_Part_Number: 581-F380J106MMAAH3; Maximum Operating Temperature: +105; Minimum Operating Temperature: -55; ROHS: Yes; ComponentLink1Description: DataSheet; ComponentLink1URL: https://www.mouser.com.tr/datasheet/2/40/f38-775706.pdf; ComponentLink2Description: Mouser; ComponentLink2URL: https://www.mouser.com.tr/ProductDetail/AVX/F380J106MMAAH3?qs=sGAEpiMZZMtZ1n0r9vR22fixilZl6Mr8zRKleESmvcDFwZ4LSyC6Pg%3D%3D; Supplier 1: Mouser; Supplier 2: Digi-Key; Supplier Part Number 2: 478-12031-1-ND; Supplier Part Number 1: 581-F380J106MMAAH3
C118 = Capacitor - 33pF [0402-6V3]: as C59 on sheet Time Management; Height: 0.5mm; Mouser_Part_Number: 80-C0402C330J9RAUTO; Maximum Operating Temperature: +125; Minimum Operating Temperature: -55; ROHS: Yes; ComponentLink1Description: DataSheet; ComponentLink1URL: https://api.kemet.com/component-edge/download/datasheet/C0402C330J9RACAUTO.pdf; ComponentLink2Description: Mouser; ComponentLink2URL: https://www.mouser.com/Search/Refine.aspx?Keyword=80-C0402C330J9RAUTO; Supplier 1: Mouser; Supplier Part Number 1: 80-C0402C330J9RAUTO
TP25 = PCB - Test Point: Test Point
U23 = IC - TPS7A0533PDBVR: as U24 on sheet 3V3 LDO Regulator (NonSleeping); Mouser_Part_Number: 595-TPS7A0533PDBVR; ComponentLink1Description: DataSheet; ComponentLink1URL: http://www.ti.com/general/docs/suppproductinfo.tsp?distId=26&gotoUrl=http%3A%2F%2Fwww.ti.com%2Flit%2Fgpn%2Ftps731; ComponentLink2Description: Mouser; ComponentLink2URL: https://eu.mouser.com/ProductDetail/Texas-Instruments/TPS73150DBVR?qs=6zVL%252ByCp0mpoSoYHNmngNA%3D%3D; Minimum Operating Temperature: -40; Output Current: 200 mA; Maximum Operating Temperature: +125; Supplier 1: Mouser; Supplier 2: Digi-Key; Case: SOT-23-5; Supplier Part Number 1: 595-TPS7A0533PDBVR; Supplier Part Number 2: 296-TPS7A0533PDBVRCT-ND

## Sheet Power Source.SchDoc: Power Source & Charger
size A4; ApprovedBy: Mehmet Günce Akkoyun; CheckedBy: Mehmet Günce Akkoyun; Author: Mehmet Günce Akkoyun; CompanyName: Ovoo Electronics; DrawnBy: Mehmet Günce Akkoyun; Organization: Ovoo Electronics; Address1: Küçük Ýhsaniye Mah.; Address2: Mýzraklý Sok. No:15; Address3: Meram / Konya; Address4: Turkiye; DocumentNumber: AA005; Revision: B106AA; SheetNumber: 2; SheetTotal: 37
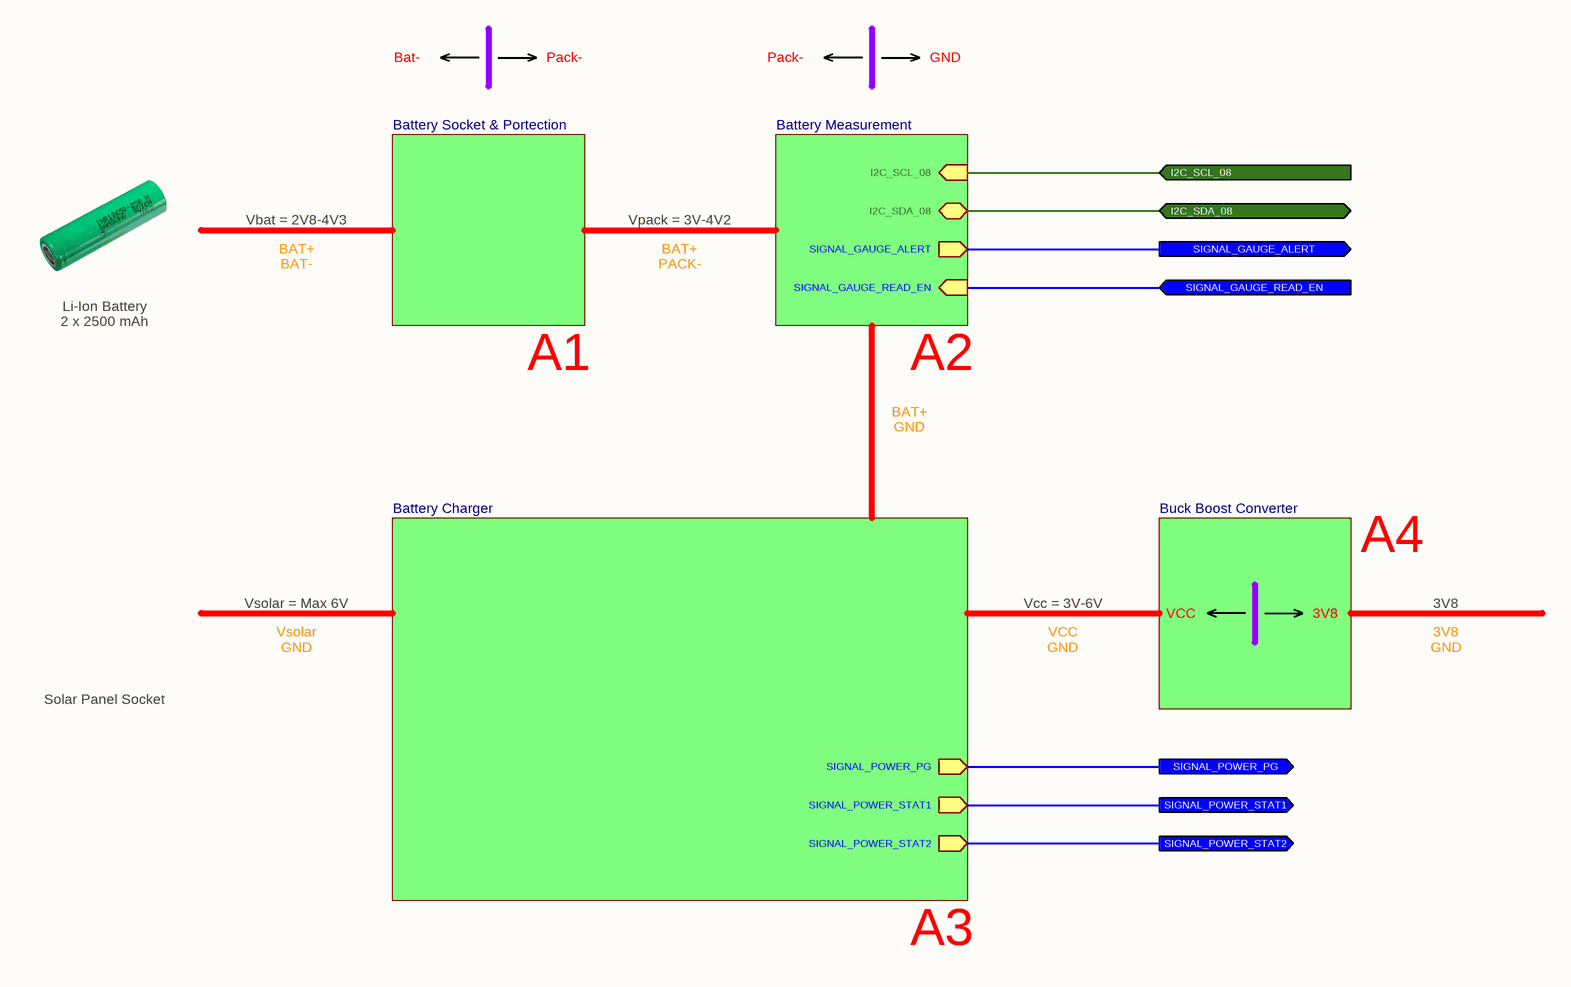
[diagram p28: Power Source.SchDoc]

### Sub-sheets
Battery Charger = Battery Charger.SchDoc: SIGNAL_POWER_STAT2 (out), SIGNAL_POWER_STAT1 (out), SIGNAL_POWER_PG (out)
Battery Measurement = Battery Measurement.SchDoc: SIGNAL_GAUGE_READ_EN (in), SIGNAL_GAUGE_ALERT (out), I2C_SCL_08 (in), I2C_SDA_08 (bidir)
Battery Socket & Portection = Battery Feed and Socket.SchDoc: no entries
Buck Boost Converter = Buck Boost Converter.SchDoc: no entries

### Ports
I2C_SCL_08 (in), I2C_SDA_08 (bidir), SIGNAL_GAUGE_ALERT (out), SIGNAL_GAUGE_READ_EN (in), SIGNAL_POWER_PG (out), SIGNAL_POWER_STAT1 (out), SIGNAL_POWER_STAT2 (out)

### Nets
I2C_SCL_08: port I2C_SCL_08, sheet Battery Measurement/I2C_SCL_08
I2C_SDA_08: port I2C_SDA_08, sheet Battery Measurement/I2C_SDA_08
SIGNAL_GAUGE_ALERT: port SIGNAL_GAUGE_ALERT, sheet Battery Measurement/SIGNAL_GAUGE_ALERT
NetC47_1: port SIGNAL_POWER_STAT1, sheet Battery Charger/SIGNAL_POWER_STAT1
NetC60_1: port SIGNAL_POWER_STAT2, sheet Battery Charger/SIGNAL_POWER_STAT2
NetC64_1: port SIGNAL_POWER_PG, sheet Battery Charger/SIGNAL_POWER_PG
NetC97_2: port SIGNAL_GAUGE_READ_EN, sheet Battery Measurement/SIGNAL_GAUGE_READ_EN

### Notes on the sheet
- Bat-
- Pack-
- GND
- Vbat = 2V8-4V3
- Vpack = 3V-4V2
- Li-Ion Battery
  2 x 2500 mAh
- BAT+
  BAT-
- BAT+
  PACK-
- A1
- BAT+
  GND
- A2
- A4
- Vsolar = Max 6V
- Vcc = 3V-6V
- VCC
- 3V8
- Solar Panel Socket
- Vsolar
  GND
- VCC
  GND
- 3V8
  GND
- A3
- Title
- Size:
- Date:
- Number:
- Time:
- Revision:
- Sheet
- of
- File: